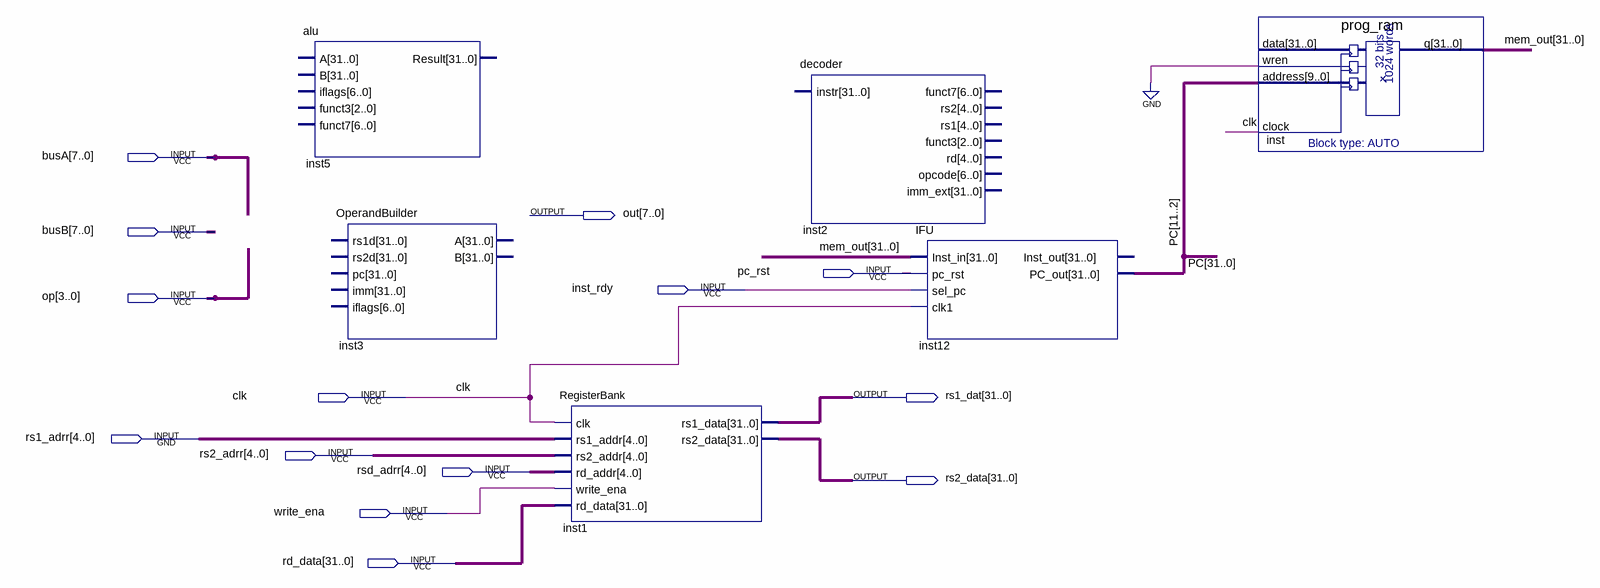
[diagram p0: schematic sheet]
// Quartus schematic uc_top.bdf as structural Verilog: 6 symbols, 14 pins
module uc_top (
  input  [7:0] busA,
  input  [7:0] busB,
  input  pc_rst,
  input  inst_rdy,
  input  [3:0] op,
  input  clk,
  input  [4:0] rs1_adrr,
  input  [4:0] rs2_adrr,
  input  [4:0] rsd_adrr,
  input  write_ena,
  input  [31:0] rd_data,
  output [7:0] out,
  output [31:0] rs1_dat,
  output [31:0] rs2_data
);

  wire [31:0] mem_out, PC;

  alu inst5 ();  // open: A, B, iflags, funct3, funct7, Result
  OperandBuilder inst3 ();  // open: rs1d, rs2d, pc, imm, iflags, A, B
  RegisterBank inst1 (
    .clk(clk), .rs1_addr(rs1_adrr), .rs2_addr(rs2_adrr), .rd_addr(rsd_adrr), .write_ena(write_ena),
    .rd_data(rd_data), .rs1_data(rs1_dat), .rs2_data(rs2_data));
  decoder inst2 ();  // open: instr, funct7, rs2, rs1, funct3, rd, opcode, imm_ext
  IFU inst12 (.Inst_in(mem_out), .pc_rst(pc_rst), .sel_pc(inst_rdy), .clk1(clk), .PC_out(PC));  // open: Inst_out
  prog_ram inst (.wren(1'b0), .address(PC[11:2]), .clock(clk), .q(mem_out));  // open: data
endmodule
